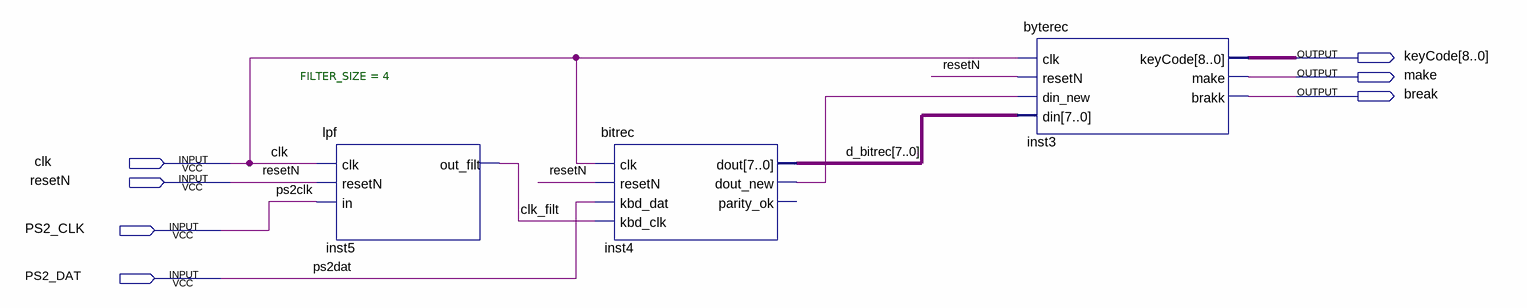
[diagram p0: schematic sheet]
// Quartus schematic KBDINTF.bdf as structural Verilog: 3 symbols, 7 pins
module KBDINTF (
  input  clk,
  input  resetN,
  input  PS2_CLK,
  input  PS2_DAT,
  output [8:0] keyCode,
  output make,
  output \break 
);

  wire clk_filt, inst4_dout_new;
  wire [7:0] d_bitrec;

  lpf #(.FILTER_SIZE(4)) inst5 (.clk(clk), .resetN(resetN), .in(PS2_CLK), .out_filt(clk_filt));
  bitrec inst4 (
    .clk(clk), .resetN(resetN), .kbd_dat(PS2_DAT), .kbd_clk(clk_filt), .dout(d_bitrec),
    .dout_new(inst4_dout_new));  // open: parity_ok
  byterec inst3 (
    .clk(clk), .resetN(resetN), .din_new(inst4_dout_new), .din(d_bitrec), .keyCode(keyCode), .make(make),
    .brakk(\break ));

  // Other names for the same wires on the sheet: ps2clk = PS2_CLK; ps2dat = PS2_DAT
endmodule
